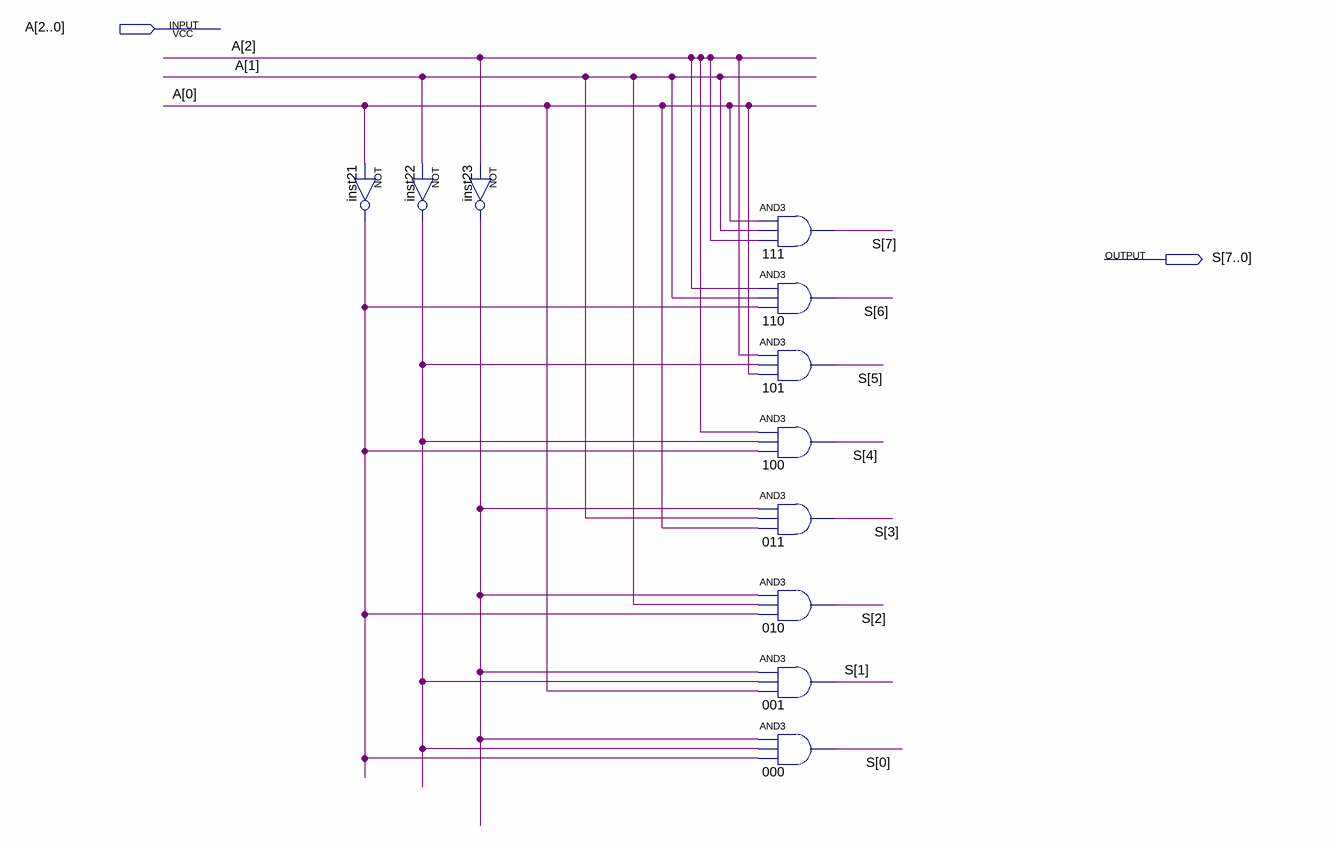
[diagram p0: schematic sheet]
// Quartus schematic decoder.bdf as structural Verilog: 11 symbols, 2 pins
module decoder (
  input  [2:0] A,
  output [7:0] S
);

  wire inst21_out, inst22_out, inst23_out;

  not inst21 (inst21_out, A[0]);
  not inst22 (inst22_out, A[1]);
  not inst23 (inst23_out, A[2]);
  and u_111 (S[7], A[0], A[1], A[2]);
  and u_110 (S[6], A[2], A[1], inst21_out);
  and u_101 (S[5], A[2], inst22_out, A[0]);
  and u_100 (S[4], A[2], inst22_out, inst21_out);
  and u_011 (S[3], inst23_out, A[1], A[0]);
  and u_010 (S[2], inst23_out, A[1], inst21_out);
  and u_001 (S[1], inst23_out, inst22_out, A[0]);
  and u_000 (S[0], inst23_out, inst22_out, inst21_out);
endmodule
